# Altium schematic sheet ReflectSensorChannel.SchDoc
size A
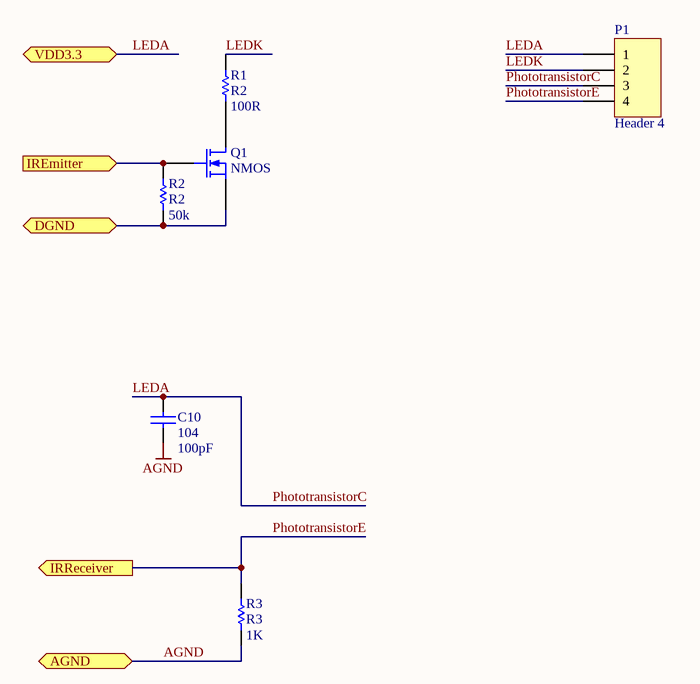
[diagram p0: ReflectSensorChannel.SchDoc]

## Parts
C10  104  value 100pF  [CAP_0805]
P1  Header 4  [PH_4_PTH]
Q1  NMOS  [SOT23-3]
R1  R2  value 100R  [RES_0805]
R2  R2  value 50k  [RES_0805]
R3  R3  value 1K  [RES_0805]

## Ports
AGND, DGND, IREmitter (in), IRReceiver (out), VDD3.3

## Nets
AGND: C10.1 R3.1 ; port AGND
DGND: Q1.3(S) R2.1 ; port DGND
IREmitter: Q1.2(G) R2.2 ; port IREmitter
LEDA: C10.2 P1.1 P1.3 ; port VDD3.3  [also labelled PhototransistorC]
LEDK: P1.2 R1.2
PhototransistorE: P1.4 R3.2 ; port IRReceiver
NetQ1_1: Q1.1(D) R1.1

## Library data of the parts
C10 = Cap: Capacitor; Published: 8-Jun-2000; LatestRevisionDate: 17-Jul-2002; LatestRevisionNote: Re-released for DXP Platform.; PackageReference: RAD-0.3; Publisher: Altium Limited; PackageDescription: Radial Cap, Thru-Hole; 2 Leads; 0.3 in Pin Spacing
P1 = Header 4: Header, 4-Pin; LatestRevisionDate: 17-Jul-2002; LatestRevisionNote: Re-released for DXP Platform.; Publisher: Altium Limited
Q1 = MOSFET-N: N-Channel MOSFET; pin to pad: 1>3 2>1 3>2; Published: 8-Jun-2000; LatestRevisionDate: 17-Jul-2002; LatestRevisionNote: Re-released for DXP Platform.; PackageVersion: 1995/1996; PackageReference: E3; Publisher: Altium Limited; PackageDescription: TO, Flat Index; 3 In-Line, Axial Leads; Body Dia. 4.6mm; Lead Dia. 0.5 mm (max)
R1-R3 = Res1: Resistor; Published: 8-Jun-2000; LatestRevisionDate: 17-Jul-2002; LatestRevisionNote: Re-released for DXP Platform.; PackageReference: AXIAL-0.3; Publisher: Altium Limited; PackageDescription: Axial Device, Thru-Hole; 2 Leads; 0.3 in Pin Spacing